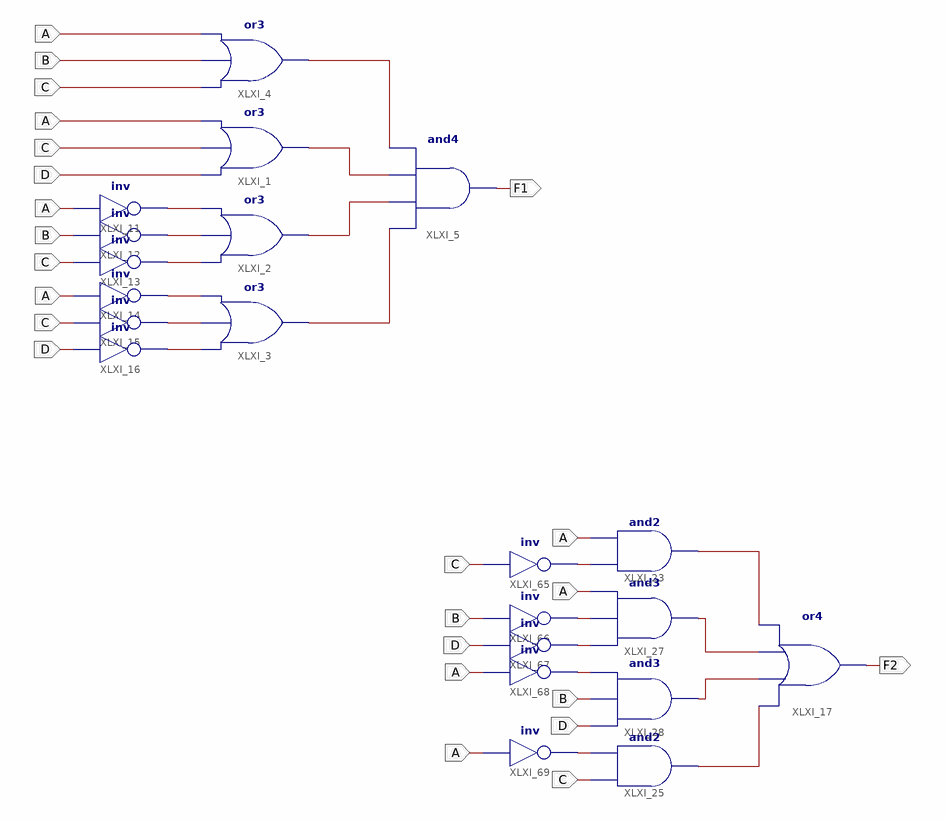
[diagram p0: schematic sheet 1]
// Xilinx ISE schematic problem21.sch (spartan3e) as structural Verilog: 21 symbols, 6 ports
module problem21 (
  input  B,
  input  C,
  input  D,
  input  A,
  output F1,
  output F2
);

  wire XLXN_1, XLXN_2, XLXN_3, XLXN_4, XLXN_11, XLXN_12, XLXN_13, XLXN_14, XLXN_15, XLXN_16, XLXN_24,
       XLXN_25, XLXN_26, XLXN_27, XLXN_46, XLXN_47, XLXN_49, XLXN_50, XLXN_51;

  or XLXI_1 (XLXN_2, D, C, A);
  or XLXI_2 (XLXN_3, XLXN_13, XLXN_12, XLXN_11);
  or XLXI_3 (XLXN_4, XLXN_16, XLXN_15, XLXN_14);
  or XLXI_4 (XLXN_1, C, B, A);
  and XLXI_5 (F1, XLXN_4, XLXN_3, XLXN_2, XLXN_1);
  not XLXI_12 (XLXN_12, B);
  not XLXI_13 (XLXN_13, C);
  not XLXI_14 (XLXN_14, A);
  not XLXI_15 (XLXN_15, C);
  not XLXI_16 (XLXN_16, D);
  not XLXI_11 (XLXN_11, A);
  and XLXI_27 (XLXN_25, XLXN_49, XLXN_47, A);
  and XLXI_23 (XLXN_24, XLXN_46, A);
  and XLXI_28 (XLXN_26, D, B, XLXN_50);
  and XLXI_25 (XLXN_27, C, XLXN_51);
  not XLXI_65 (XLXN_46, C);
  not XLXI_66 (XLXN_47, B);
  not XLXI_67 (XLXN_49, D);
  not XLXI_68 (XLXN_50, A);
  not XLXI_69 (XLXN_51, A);
  or XLXI_17 (F2, XLXN_27, XLXN_26, XLXN_25, XLXN_24);
endmodule
